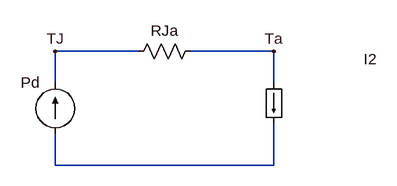
[diagram p0: schematic Circuito_Termico.asc]
Circuito_Termico.asc, the LTspice schematic file:
Version 4.1
SHEET 1 880 680
WIRE 224 64 96 64
WIRE 432 64 304 64
WIRE 96 112 96 64
WIRE 432 112 432 64
WIRE 96 240 96 192
WIRE 432 240 432 176
WIRE 432 240 96 240
FLAG 96 64 TJ
FLAG 432 64 Ta
SYMBOL current 96 192 R180
WINDOW 0 24 80 Left 2
WINDOW 3 24 0 Left 2
SYMATTR InstName Pd
SYMATTR Value ""
SYMBOL res 320 48 R90
WINDOW 0 0 56 VBottom 2
WINDOW 3 32 56 VTop 2
SYMATTR InstName RJa
SYMATTR Value ""
SYMBOL load 416 112 R0
WINDOW 0 154 -36 Left 2
SYMATTR InstName I2
SYMATTR Value ""

The netlist it stands for:
* Circuito_Termico.asc
I§Pd N001 TJ
RJa Ta TJ
I2 Ta N001
.backanno
.end